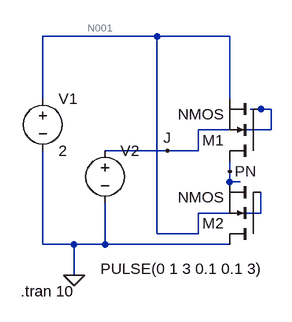
[diagram p0: schematic Draft4.asc]
Draft4.asc, the LTspice schematic file:
Version 4
SHEET 1 880 680
WIRE 256 16 80 16
WIRE 368 16 256 16
WIRE 80 112 80 16
WIRE 368 112 368 16
WIRE 416 128 400 128
WIRE 432 128 416 128
WIRE 432 160 432 128
WIRE 432 160 320 160
WIRE 272 192 176 192
WIRE 320 192 320 160
WIRE 320 192 272 192
WIRE 368 224 368 208
WIRE 368 240 368 224
WIRE 384 240 368 240
WIRE 416 288 416 256
WIRE 416 288 320 288
WIRE 256 320 256 16
WIRE 320 320 320 288
WIRE 320 320 256 320
WIRE 80 336 80 192
WIRE 128 336 80 336
WIRE 176 336 176 272
WIRE 176 336 128 336
WIRE 368 336 176 336
WIRE 128 384 128 336
FLAG 128 384 0
FLAG 368 224 PN
FLAG 272 192 J
SYMBOL voltage 80 96 R0
WINDOW 123 0 0 Left 0
WINDOW 39 0 0 Left 0
SYMATTR InstName V1
SYMATTR Value 2
SYMBOL voltage 176 176 R0
WINDOW 3 -7 198 Left 2
WINDOW 123 0 0 Left 0
WINDOW 39 0 0 Left 0
SYMATTR InstName V2
SYMATTR Value PULSE(0 1 3 0.1 0.1 3)
SYMBOL nmos 416 208 R180
SYMATTR InstName M1
SYMBOL nmos 416 336 R180
SYMATTR InstName M2
TEXT 46 408 Left 2 !.tran 10

The netlist it stands for:
* Draft4.asc
V1 N001 0 2
V2 J 0 PULSE(0 1 3 0.1 0.1 3)
M1 PN J N001 N001 NMOS
M2 0 N001 PN PN NMOS
.model NMOS NMOS
.model PMOS PMOS
.lib standard.mos
.tran 10
.backanno
.end

* Results of the author's LTspice run, read from the files saved beside the schematic
* Operating Point, zero values left out:
*   V(n001) = 2 V
*   V(pn) = 1 V
*   Id(M2) = -617.8 A
*   Ib(M2) = 617.8 A
*   Is(M2) = 30 µA
*   Id(M1) = -617.8 A
*   Ib(M1) = 617.8 A
*   Is(M1) = 1.023 pA
*   I(V1) = -617.8 A
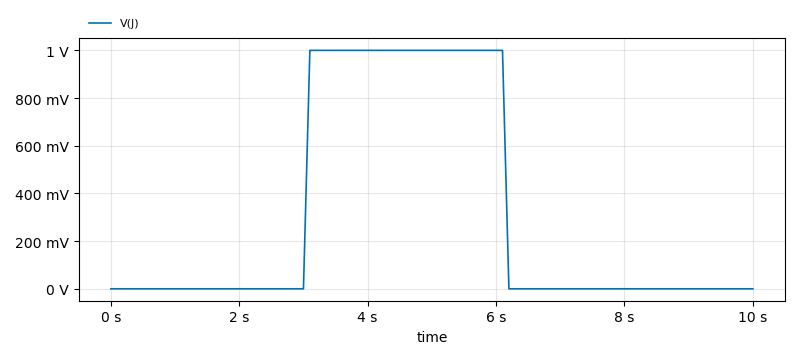
[diagram p1: Transient Analysis of Draft4.asc, plotted from the saved traces]
* Transient Analysis, 1 run:
*   V(J): min 0 V, max 1 V, average 310 mV, rms 556.8 mV, last 0 V